# EAGLE design smd_can4vscp_usb_0.0.1 (EAGLE 5.11)
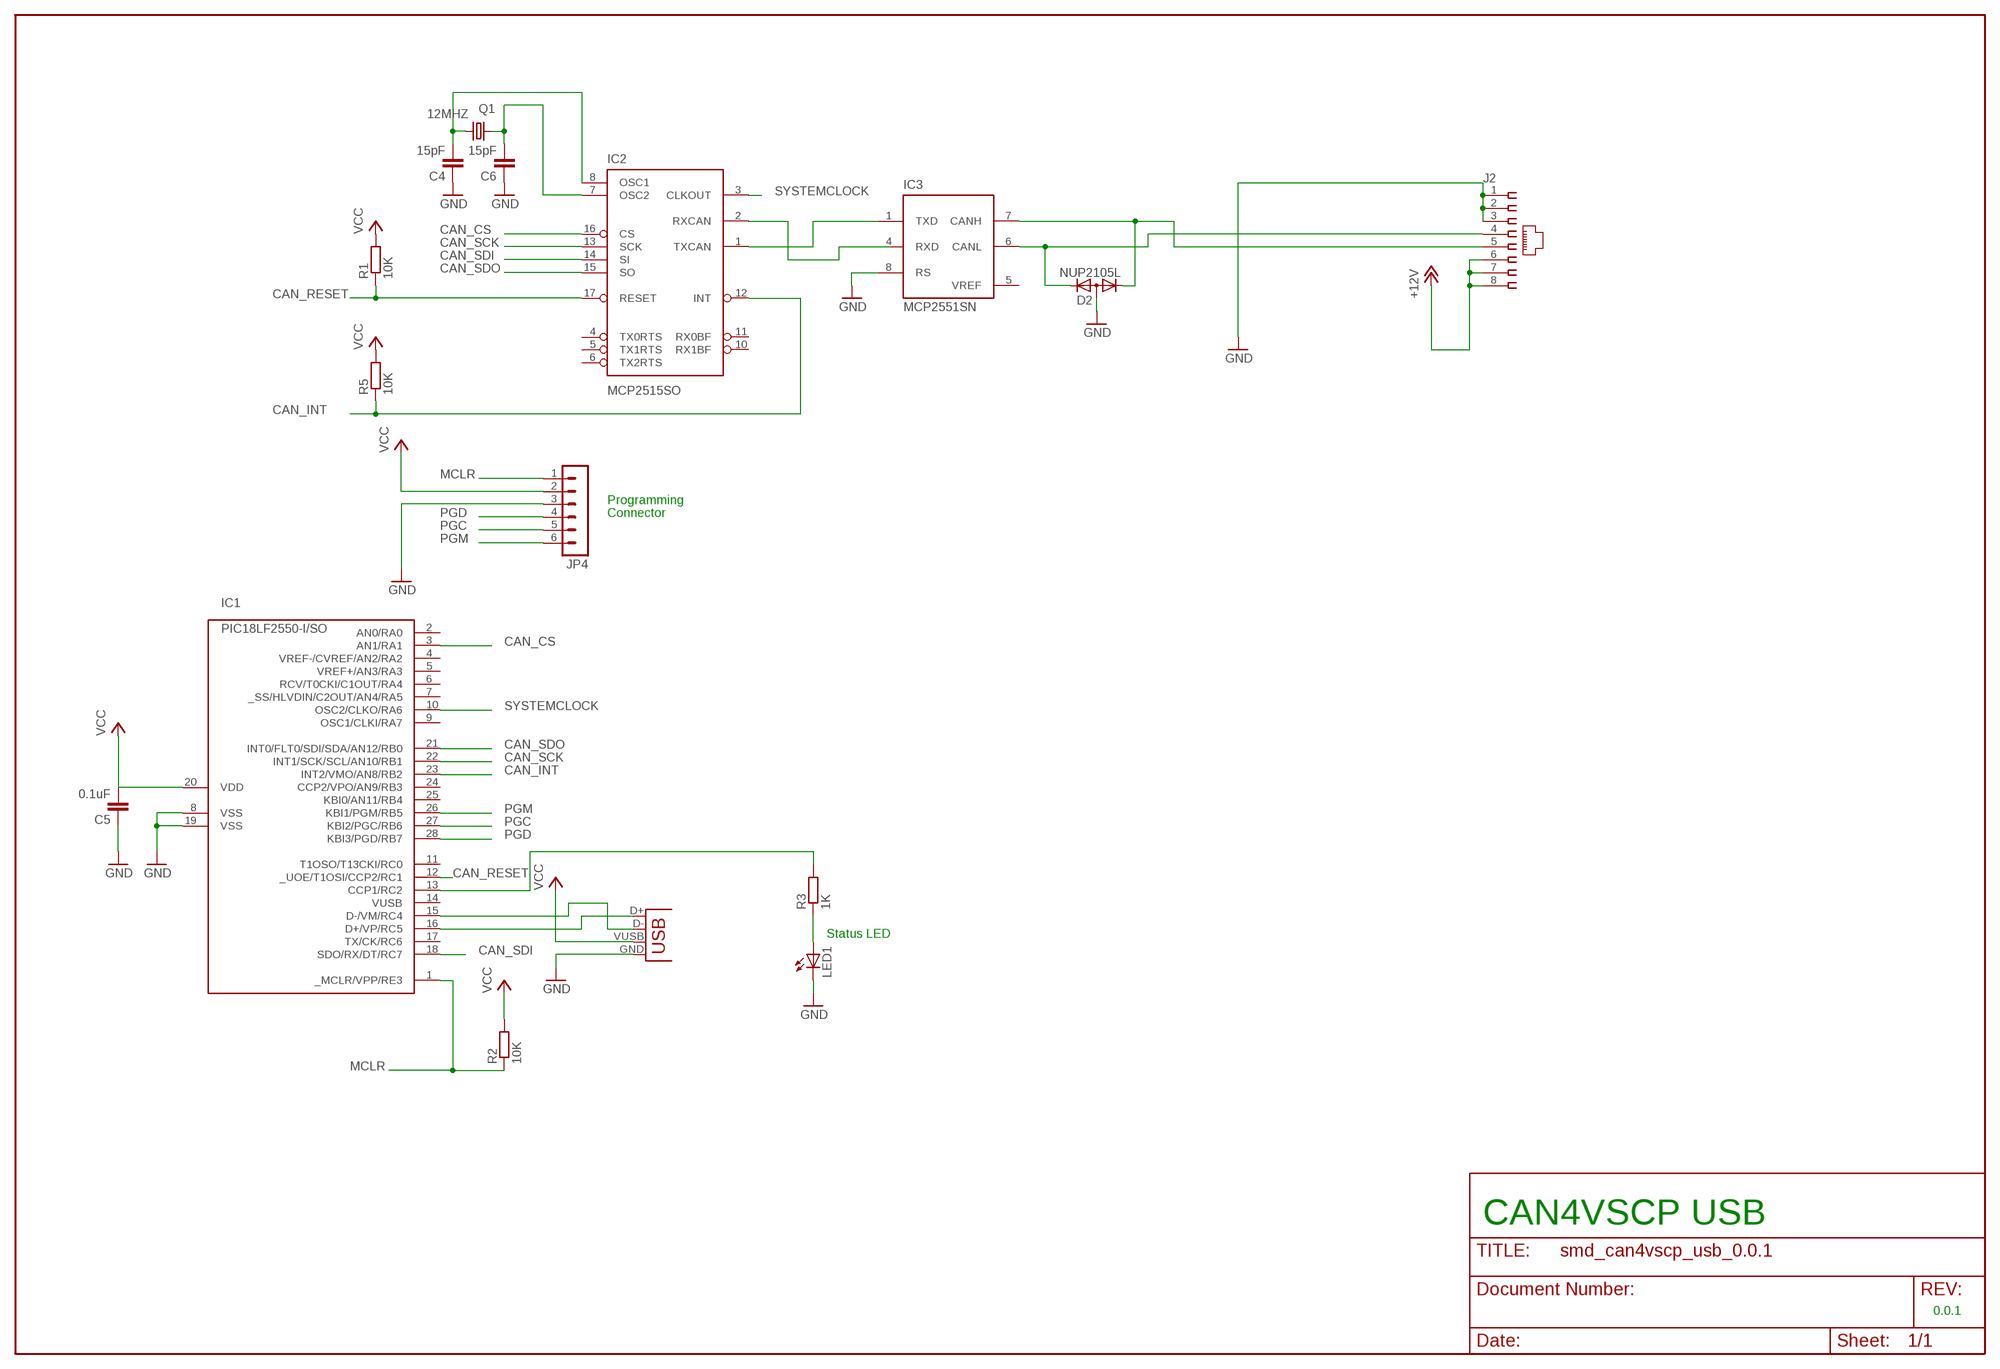
[diagram p0: schematic, sheet 1]

## Parts
C4  15pF  C-EUC0805  [C0805]
C5  0.1uF  C-EUC0805  [C0805]
C6  15pF  C-EUC0805  [C0805]
D2  NUP2105L  DIODE-2CA|ACSOT23  [SOT23]
IC1  PIC18LF2550-I/SO  [SO-28W]
IC2  MCP2515SO  MCP2510SO  [SO-18W]
IC3  MCP2551SN  [SO-08]
J2  520426-4  [520426-4]
JP4  MA06-1  [MA06-1]
LED1  LED3MM  [LED3MM]
Q1  12MHZ  CRYSTALHC49U-H  [HC49U-H]
R1  10K  R-EU_R0805  [R0805]
R2  10K  R-EU_R0805  [R0805]
R3  1K  R-EU_R0805  [R0805]
R5  10K  R-EU_R0805  [R0805]
X1  USB-B-S  [USB-B-SMT]

## Nets
+12V: J2.6 J2.7 J2.8
CAN_CS: IC1.3(AN1/RA1) IC2.16(CS)
CAN_INT: IC1.23(INT2/VMO/AN8/RB2) IC2.12(INT) R5.1
CAN_RESET: IC1.12(_UOE/T1OSI/CCP2/RC1) IC2.17(RESET) R1.1
CAN_SCK: IC1.22(INT1/SCK/SCL/AN10/RB1) IC2.13(SCK)
CAN_SDI: IC1.18(SDO/RX/DT/RC7) IC2.14(SI)
CAN_SDO: IC1.21(INT0/FLT0/SDI/SDA/AN12/RB0) IC2.15(SO)
CANH: D2.1(K1) IC3.7(CANH) J2.5
CANL: D2.2(K2) IC3.6(CANL) J2.4
GND: C4.1 C5.1 C6.1 D2.3(A) IC1.8(VSS) IC1.19(VSS) IC3.8(RS) J2.1 J2.2 J2.3 JP4.3 LED1.K(C) X1.GND
MCLR: IC1.1(_MCLR/VPP/RE3) JP4.1 R2.1
N$1: IC1.16(D+/VP/RC5) X1.D+
N$2: C4.2 IC2.8(OSC1) Q1.1
N$3: IC1.15(D-/VM/RC4) X1.D-
N$4: IC2.1(TXCAN) IC3.1(TXD)
N$5: LED1.A R3.1
N$6: IC1.13(CCP1/RC2) R3.2
N$7: C6.2 IC2.7(OSC2) Q1.2
N$8: IC2.2(RXCAN)
PGC: IC1.27(KBI2/PGC/RB6) JP4.5
PGD: IC1.28(KBI3/PGD/RB7) JP4.4
PGM: IC1.26(KBI1/PGM/RB5) JP4.6
SYSTEMCLOCK: IC1.10(OSC2/CLKO/RA6) IC2.3(CLKOUT)
VCC: C5.2 IC1.20(VDD) JP4.2 R1.2 R2.2 R5.2 X1.VUSB(VBUS)
Unconnected: IC1.2(AN0/RA0) IC1.4(VREF-/CVREF/AN2/RA2) IC1.5(VREF+/AN3/RA3) IC1.6(RCV/T0CKI/C1OUT/RA4) IC1.7(_SS/HLVDIN/C2OUT/AN4/RA5) IC1.9(OSC1/CLKI/RA7) IC1.11(T1OSO/T13CKI/RC0) IC1.14(VUSB) IC1.17(TX/CK/RC6) IC1.24(CCP2/VPO/AN9/RB3) IC1.25(KBI0/AN11/RB4) IC2.4(TX0RTS) IC2.5(TX1RTS) IC2.6(TX2RTS) IC2.10(RX1BF) IC2.11(RX0BF) IC3.4(RXD)

## Notes on the sheet
- Programming
- Connector
- Status LED
- CAN4VSCP USB
- 0.0.1

## Power pins joined to a net without a drawn wire
GND: IC3.2(VSS)
VCC: IC3.3(VDD)
VDD: IC2.18(VDD)
VREF: IC3.5(VREF)
VSS: IC2.9(VSS)

## Library data of the parts
C4-C6 = rcl:C-EU: CAPACITOR, European symbol
D2 = diode:DIODE-2CA|AC: Dual DIODE Cathode-Anode|Anode-Cathode
IC1 = microchip-pic18fxx5x:PIC18*2550: PIC18*2550 Microchip FLASH Microcontroller with FS-USB DEVICE FEATURES Feature PIC18*2550 Program Memory (bytes) 32k Program Memory (instructions) 16384 I/O Ports Ports A, B, C, (E) Capture/Compare/PWM Modules 2 Enhanced Capture/Compare/PWM Modules 0 Parallel Communications (PSP) No 10-bit Analog-to-Digital Module 10 input Channels Package Types 28-pin PDIP 28-pin SOIC NOTES: F only after 18, means standard voltage range from 4.2v to 5.5v LF after 18, means extended voltage range from 2.0v to 5.5v T after entire device number, means supplied in tape and reel TQFP packages only -E before / denotes extended temperature range from -40°C to +120°C -I before / denotes industrial temperature range from -40°C to +85°C /PT suffix denotes TQFP package /SO suffix denotes SOIC package /SP suffix denotes Skinny Plastic DIP package /P suffix denotes Plastic DIP package /ML suffix denotes QFN package
IC2 = microchip_can:MCP2510
IC3 = microchip_can:MCP2551: High Speed CAN tranceiver
J2 = con-amp:520426-4: AMP connector
JP4 = con-lstb:MA06-1
LED1 = led:LED: LED OSRAM: - CHIPLED LG R971, LG N971, LY N971, LG Q971, LY Q971, LO R971, LY R971 LH N974, LH R974 LS Q976, LO Q976, LY Q976 LO Q996 - Hyper CHIPLED LW Q18S LB Q993, LB Q99A, LB R99A - SideLED LS A670, LO A670, LY A670, LG A670, LP A670 LB A673, LV A673, LT A673, LW A673 LH A674 LY A675 LS A676, LA A676, LO A676, LY A676, LW A676 LS A679, LY A679, LG A679 - Hyper Micro SIDELED® LS Y876, LA Y876, LO Y876, LY Y876 LT Y87S - SmartLED LW L88C, LW L88S LB L89C, LB L89S, LG L890 LS L89K, LO L89K, LY L89K LS L896, LA L896, LO L896, LY L896 - TOPLED LS T670, LO T670, LY T670, LG T670, LP T670 LSG T670, LSP T670, LSY T670, LOP T670, LYG T670 LG T671, LOG T671, LSG T671 LB T673, LV T673, LT T673, LW T673 LH T674 LS T676, LA T676, LO T676, LY T676, LB T676, LH T676, LSB T676, LW T676 LB T67C, LV T67C, LT T67C, LS T67K, LO T67K, LY T67K, LW E67C LS E67B, LA E67B, LO E67B, LY E67B, LB E67C, LV E67C, LT E67C LW T67C LS T679, LY T679, LG T679 LS T770, LO T770, LY T770, LG T770, LP T770 LB T773, LV T773, LT T773, LW T773 LH T774 LS E675, LA E675, LY E675, LS T675 LS T776, LA T776, LO T776, LY T776, LB T776 LHGB T686 LT T68C, LB T68C - Hyper Mini TOPLED® LB M676 - Mini TOPLED Santana® LG M470 LS M47K, LO M47K, LY M47K Source: http://www.osram.convergy.de/
Q1 = crystal:CRYSTAL: CRYSTAL
R1-R3 R5 = rcl:R-EU_: RESISTOR, European symbol
X1 = con-usb:USB: USB Connectors

## Board
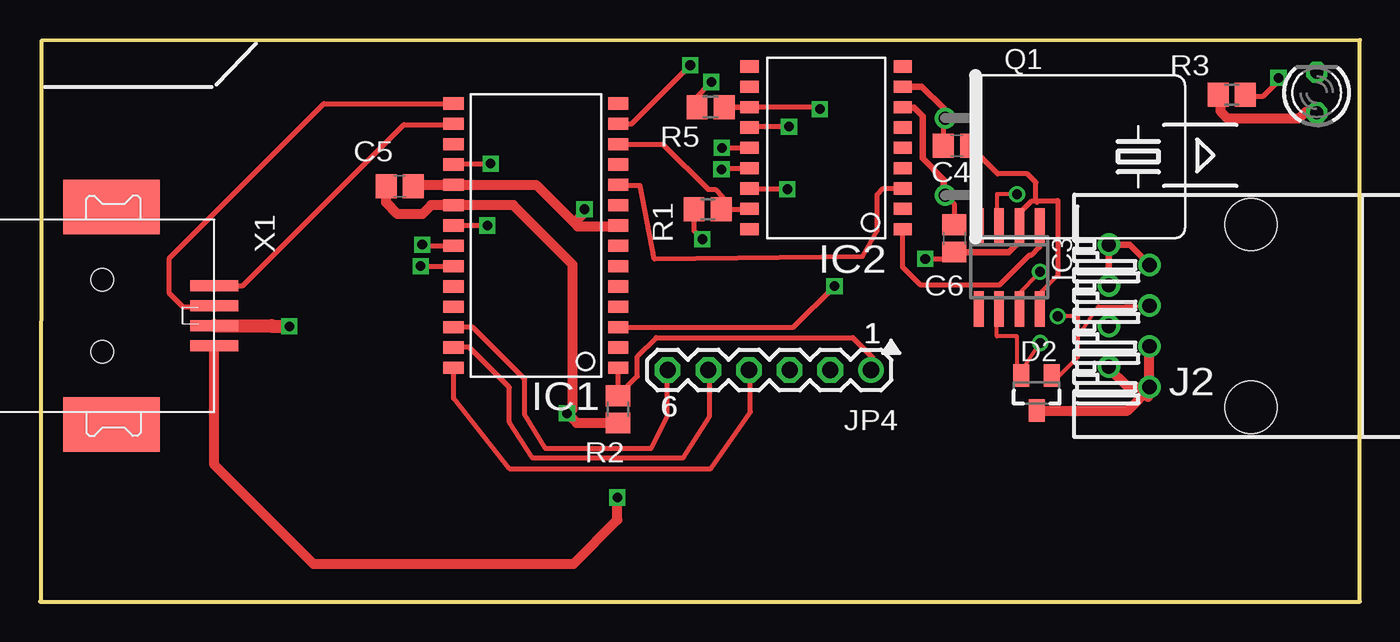
[diagram p1: board, top side]
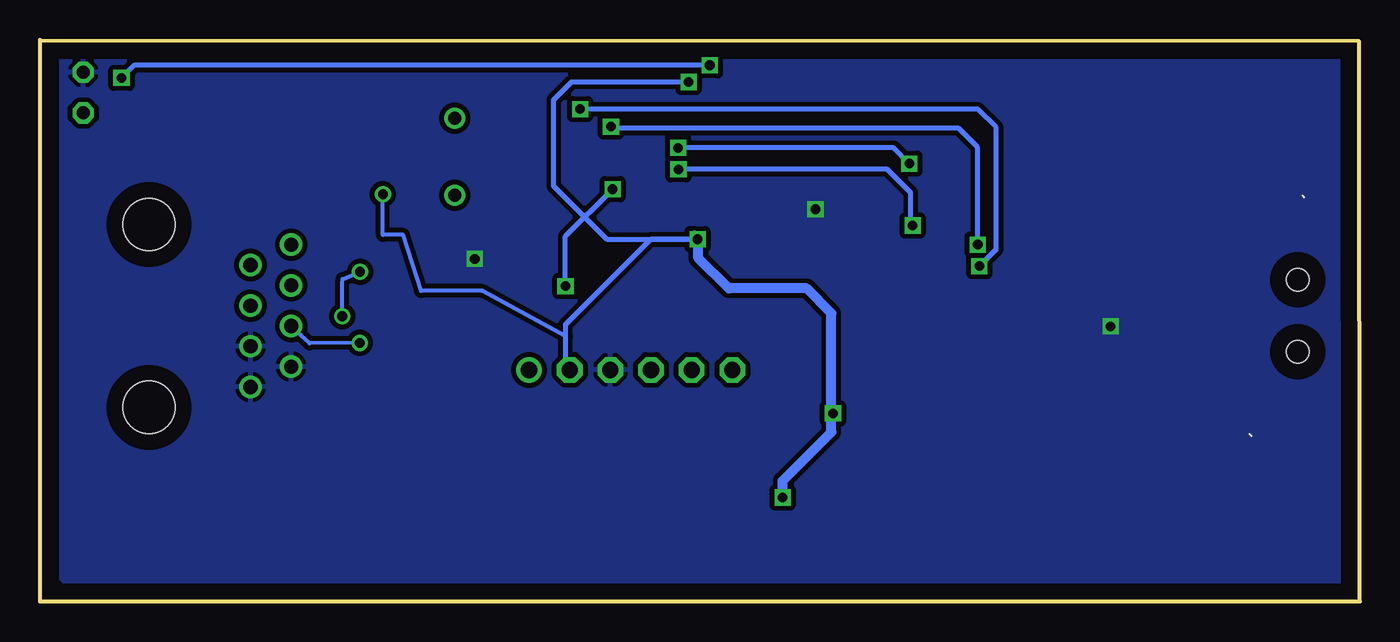
[diagram p2: board, bottom side, seen from below]

Size 82.46 x 35.08 mm. Coordinates in mm from the lower left corner, seen from the top.
Outline: 0,0 82.46,0 82.46,35.08 0.09,35.03 0.04,0.01
Copper layers (1*16): Top 0.035mm / dielectric 1.5mm / Bottom 0.035mm
Design rules "10mils": minimum track width 10mil, minimum drill 24mil, track to track 10mil, track to pad 10mil, pad to pad 10mil, via to via 10mil, smd to smd 10mil, copper to edge 40mil, drill to drill 10mil, minimum pad ring 10mil, minimum via ring 8mil, stop-mask expansion 0mil, vias tented up to drill 0mil, thermal gap 10mil

### Footprints (pad centres in the part's own frame; a part is rotated, then mirrored left to right if it is on the bottom)
C0805 = smd 1.3 x 1.5: 1 -0.85,0; 2 0.85,0
SOT23 = smd 1 x 1.4: 1 -0.95,-1.1; 2 0.95,-1.1; 3 0,1.1
SO-28W = smd 0.762 x 1.27: 1 -7.62,-5.207; 2 -6.35,-5.207; 3 -5.08,-5.207; 4 -3.81,-5.207; 5 -2.54,-5.207; 6 -1.27,-5.207; 7 0,-5.207; 8 1.27,-5.207; 9 2.54,-5.207; 10 3.81,-5.207; 11 5.08,-5.207; 12 6.35,-5.207; 13 7.62,-5.207; 14 8.89,-5.207; 15 8.89,5.08; 16 7.62,5.08; 17 6.35,5.08; 18 5.08,5.08; 19 3.81,5.08; 20 2.54,5.08; 21 1.27,5.08; 22 0,5.08; 23 -1.27,5.08; 24 -2.54,5.08; 25 -3.81,5.08; 26 -5.08,5.08; 27 -6.35,5.08; 28 -7.62,5.08
SO-18W = smd 0.762 x 1.143: 1 -5.08,-4.788; 2 -3.81,-4.788; 3 -2.54,-4.788; 4 -1.27,-4.788; 5 0,-4.788; 6 1.27,-4.788; 7 2.54,-4.788; 8 3.81,-4.788; 9 5.08,-4.788; 10 5.08,4.788; 11 3.81,4.788; 12 2.54,4.788; 13 1.27,4.788; 14 0,4.788; 15 -1.27,4.788; 16 -2.54,4.788; 17 -3.81,4.788; 18 -5.08,4.788
SO-08 = smd 0.6 x 2.2: 1 -1.905,-2.6; 2 -0.635,-2.6; 3 0.635,-2.6; 4 1.905,-2.6; 5 1.905,2.6; 6 0.635,2.6; 7 -0.635,2.6; 8 -1.905,2.6
520426-4 = drill 0.889 round: 1 -4.445,6.35; 2 -3.175,8.89; 3 -1.905,6.35; 4 -0.635,8.89; 5 0.635,6.35; 6 1.905,8.89; 7 3.175,6.35; 8 4.445,8.89 | hole 3.251: -5.715,0; 5.715,0
MA06-1 = drill 1.016 pad 1.6 round: 1 -6.35,0 | drill 1.016 pad 1.6 octagon: 2 -3.81,0; 3 -1.27,0; 4 1.27,0; 5 3.81,0; 6 6.35,0
LED3MM = drill 0.813 octagon: A -1.27,0; K 1.27,0
HC49U-H = drill 0.813 round: 1 -2.413,-5.08; 2 2.413,-5.08
R0805 = smd 1.3 x 1.5: 1 -0.85,0; 2 0.85,0
USB-B-SMT = smd 6.04 x 3.4: 5 0.58,6.8; 6 0.58,-6.8 | smd 3 x 0.7: D+ 7,1.875; D- 7,0.625; GND 7,-0.625; VUSB 7,-1.875 | hole 1.4: 0,2.25; 0,-2.25

### Placement (x,y rotation side)
C4  57.28,28.47 180 top
C5  22.47,25.94 180 top
C6  57.13,22.68 90 top
D2  62.26,13.03 180 top
IC1  30.92,22.22 90 top
IC2  49.1,28.35 90 top
IC3  60.55,20.88 180 top
J2  75.66,17.85 90 top
JP4  45.56,14.47 180 top
LED1  79.76,31.79 90 top
Q1  61.62,27.79 270 top
R1  41.71,24.51 180 top
R2  36.11,12.01 270 top
R3  74.45,31.66 0 top
R5  41.89,30.89 180 top
X1  3.89,17.86 0 top

### Tracks (layer width: path | path; a pad name or v marks a point on that pad's centre or on a via)
+12V
  Top 0.406: J2.6 J2.8 | J2.8 66.77,22.36 66.75,22.38 | 69.35,21.03 69.37,21 | 69.35,21.03 J2.7 | J2.8 68.08,22.3 69.35,21.03
CAN_CS  (via drill 0.6)
  Top 0.305: IC1.3 47.07,17.14 v49.63,19.71 | IC2.16 44.28,25.86 | IC2.16 | v46.69,25.75 44.38,25.75 IC2.16
  Bottom 0.305: v49.63,19.71 49.63,22.81 v46.69,25.75
CAN_INT  (via drill 0.6)
  Top 0.305: 44.31,30.87 44.43,30.76 | 44.31,30.87 IC2.12 | 44.31,30.87 IC2.12 R5.1 48.59,30.89 v48.72,30.76 | 26.11,20.95 IC1.23 | v23.78,20.95 26.11,20.95 | 26.11,20.95 26.27,20.8
  Bottom 0.305: v48.72,30.76 23.88,30.76 22.74,29.62 22.74,22 v23.78,20.95
CAN_RESET
  Top 0.305: 44.43,24.51 44.4,24.54 IC2.17 | 44.43,24.51 R1.1 42.47,24.51 42.62,24.66 42.62,25.3 42.17,25.75 41.74,25.75 38.92,28.57 IC1.12 | 44.43,24.51 44.48,24.46
CAN_SCK  (via drill 0.6)
  Top 0.305: IC1.22 23.96,22.22 v23.88,22.3 | 44.31,29.6 44.17,29.46 | 44.31,29.6 IC2.13 | v46.79,29.67 44.38,29.67 44.31,29.6
  Bottom 0.305: v23.88,22.3 23.88,28.37 25.07,29.57 46.69,29.57 v46.79,29.67
CAN_SDI  (via drill 0.6)
  Top 0.305: v42.6,28.35 IC2.14 | IC1.18 25.81,27.33 25.84,27.36 v28.15,27.36
  Bottom 0.305: v42.6,28.35 29.14,28.35 v28.15,27.36
CAN_SDO  (via drill 0.6)
  Top 0.305: IC2.15 42.62,27.08 v42.57,27 | IC1.21 25.71,23.49 | 25.71,23.49 v27.94,23.49 | 25.71,23.49 25.66,23.44
  Bottom 0.305: v42.57,27 29.52,27 28.07,25.55 28.07,23.62 v27.94,23.49
CANH  (via drill 0.61)
  Top 0.254: 64.85,16.56 64.85,15.29 63.58,14.02 D2.1 | 64.85,16.56 66.11,18.42 69.41,18.47 J2.5 | v62.47,20.6 61.04,19.1 IC3.7 | v63.58,17.83 64.85,17.83 64.85,16.56
  Bottom 0.254: v63.58,17.83 63.58,19.94 63.55,20.14 v62.47,20.6
CANL  (via drill 0.61)
  Top 0.254: 61.04,14.02 61.04,16.56 59.77,16.56 59.77,17.83 IC3.6 | 61.04,14.02 v62.49,16.15 | D2.2 61.04,14.02
  Bottom 0.254: v62.49,16.15 65.61,16.13 66.16,16.64 J2.4
GND  (via drill 0.6)
  Top 0.254: 63.58,20.37 62.31,19.1 IC3.8
  Top 0.305: 63.58,20.37 63.58,25.06 63.5,25.06 63.47,25.03 62.28,25.03 | 61.18,24.25 61.97,25.03 62.28,25.03 | C4.1 58.13,28.41 59.82,26.72 61.67,26.72 62.21,26.19 62.21,25.02 62.28,24.94 62.28,25.03 | 23.27,26.03 23.32,25.98 C5.1 | IC1.8 36.12,23.44 36.22,23.34 | 34.09,24.38 34.01,24.46 v34.01,24.51 | C6.1 57.22,21.83 57.28,21.77 56.92,21.41 v55.3,21.41 | 14.45,17.23 14.48,17.2 | v15.57,17.2 15.65,17.2 15.68,17.22
  Top 0.406: 61.18,24.25 IC3.2 61.17,23.47 61.27,23.37 61.27,22.58 60.52,21.83 C6.1 | 62.55,11.93 62.61,11.86 | D2.3 62.55,11.93 | 62.55,11.93 62.54,11.94
  Top 0.61: 69.22,13.36 69.26,13.41 J2.1 | 69.22,13.36 69.22,12.78 | J2.3 | J2.1 J2.3 | J2.3 69.3,15.98 | 66.68,14.68 | 66.68,14.68 J2.2 | 69.22,13.36 68,13.36 66.68,14.68 | 69.42,13.41 69.45,13.44 | 69.42,13.41 J2.1 | D2.3 67.94,11.93 69.42,13.41 | 23.27,26.03 IC1.19 30.99,26.03 33.58,23.44 | 33.58,23.44 36.12,23.44 | 33.58,23.44 33.58,23.88 34.09,24.38
  Top 0.813: X1.GND 14.45,17.23 | 14.48,17.2 15.65,17.2
  pour Bottom (isolate 0.305): 0.67,34.09 0.67,1.45 1.26,0.86 80.55,0.86 81.52,1.83 81.52,34.32 81.59,34.39 1.04,34.39 0.82,34.17
MCLR
  Top 0.305: IC1.1 36.12,13 36.17,12.95 36.11,12.89 R2.1 37.32,14.07 37.32,15.32 38.48,16.48 50.78,16.48 52,15.27 52,14.38 JP4.1
N$1
  Top 0.305: X1.D+ 12.67,19.73 22.74,29.79 26.09,29.79 26.14,29.84 | 26.14,29.84 26.19,29.89 | 26.14,29.84 IC1.16
N$2
  Top 0.305: 56.77,30.15 56.72,30.2 Q1.1 56.54,30.17 56.57,30.15 56.43,30.01 C4.2
  Top 0.406: IC2.8 55.1,32.16 56.42,30.84 56.42,30.28 56.52,30.17 Q1.1
N$3
  Top 0.305: IC1.15 17.73,31.11 8.08,21.46 8.08,19.25 8.92,18.41 11.03,18.41 | 11.03,18.41 10.96,18.48 X1.D- | 11.03,18.41 11.08,18.36
N$4
  Top 0.305: IC2.1 53.89,20.89 54.99,19.79 59.95,19.79 61.8,21.64 61.95,21.64 62.44,22.12 62.44,23.21 62.54,23.32 62.45,23.4 IC3.1
N$5
  Top 0.254: R3.1 73.74,31.8
  Top 0.61: 73.74,31.8 73.74,30.63 74.17,30.2 78.67,30.2 79.05,30.58 79.07,30.56 LED1.A
N$6  (via drill 0.6)
  Top 0.305: IC1.13 36.96,29.84 v40.62,33.5 | v77.37,32.71 77.37,32.54 76.38,31.55 75.47,31.55 75.35,31.66 R3.2
  Bottom 0.305: v40.62,33.5 76.58,33.5 v77.37,32.71
N$7
  Top 0.305: 56.54,25.45 56.57,25.48 | 56.54,25.4 56.54,25.45 | 56.54,25.45 56.47,25.37 | Q1.2 56.54,25.4 | C6.2 57.13,24.82 56.54,25.4
  Top 0.406: 56.47,25.37 56.47,26.36 55.15,27.69 55.15,30.33 54.61,30.86 53.98,30.86 53.89,30.95 | 53.89,30.95 53.85,30.99 | 53.89,30.95 IC2.7
PGC
  Top 0.305: IC1.27 26.83,15.87 29.31,13.39 29.31,11.2 30.74,8.99 40.19,8.99 41.84,11.58 41.84,14.25 41.75,14.34 JP4.5
PGD
  Top 0.305: IC1.28 25.84,12.7 29.31,8.31 41.91,8.31 44.38,11.84 44.38,14.76 | 44.38,14.76 44.29,14.67 JP4.4 | 44.38,14.76 44.45,14.83
PGM
  Top 0.305: IC1.26 27.03,17.14 30.28,13.89 30.28,11.68 31.58,9.58 38.18,9.58 39.17,11.58 39.17,14.33 39.3,14.45 39.28,14.47 JP4.6
SYSTEMCLOCK
  Top 0.305: IC2.3 52.68,25.81 52.3,25.43 52.3,23.16 51.39,21.56 38.38,21.41 37.49,25.98 36.27,25.98 36.25,25.96 36.17,26.03 IC1.10
VCC  (via drill 0.6, 0.61)
  Top 0.254: IC3.3 59.77,24.18 59.77,25.45 v61.04,25.45
  Top 0.305: R5.2 41.15,30.78 40.86,30.49 40.86,31.38 v41.94,32.46 | R1.2 40.86,23.15 v41.38,22.63
  Top 0.61: X1.VUSB 10.89,8.54 17.07,2.36 33.33,2.36 36.07,5.1 v36.07,6.5 | R2.2 33.52,11.16 v32.92,11.76 32.92,11.66 | 32.92,11.66 32.87,11.61 | 32.92,11.66 33.28,12.01 33.28,21.06 29.57,24.76 IC1.20 25.99,24.76 | C5.2 21.62,24.92 22.33,24.21 23.88,24.21 24.44,24.76 25.99,24.76 | 25.99,24.76 26.04,24.82
  Bottom 0.254: v61.04,25.45 61.04,22.91 59.77,22.91 58.65,19.41 54.84,19.41 49.61,16.56 49.61,15.29 | 49.61,15.29 49.61,14.02 | 49.63,15.29 49.61,15.29
  Bottom 0.305: JP4.2 49.37,14.36 49.41,14.33 49.63,14.55 49.63,15.29 49.63,17.3 44.3,22.63 v41.38,22.63 41.38,22.55 41.43,22.61 47.02,22.61 50.37,25.96 50.37,31.34 49.25,32.46 v41.94,32.46
  Bottom 0.61: v36.07,6.5 36.07,7.54 33.02,10.59 33.02,11.66 | 33.02,11.66 33.02,18.01 34.57,19.56 39.42,19.56 41.33,21.46 41.33,22.61 41.38,22.66 | 41.38,22.66 41.58,22.86 | 41.38,22.66 v41.38,22.63 | 33.02,11.66 33.07,11.66 32.97,11.76 v32.92,11.76

### Text on the board
tNames: 1 | 6 | 6